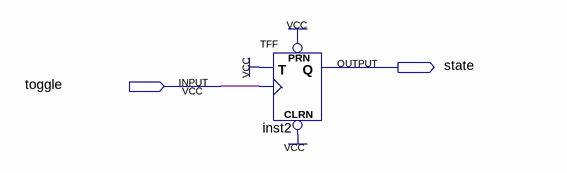
[diagram p0: schematic sheet]
// Quartus schematic flipflop_state.bdf as structural Verilog: 1 symbols, 2 pins
module flipflop_state (
  input  toggle,
  output state
);

  TFF inst2 (.PRN(1'b1), .CLRN(1'b1), .T(1'b1), .CLK(toggle), .Q(state));
endmodule
